# Altium schematic sheet Sheet1.SchDoc
size A
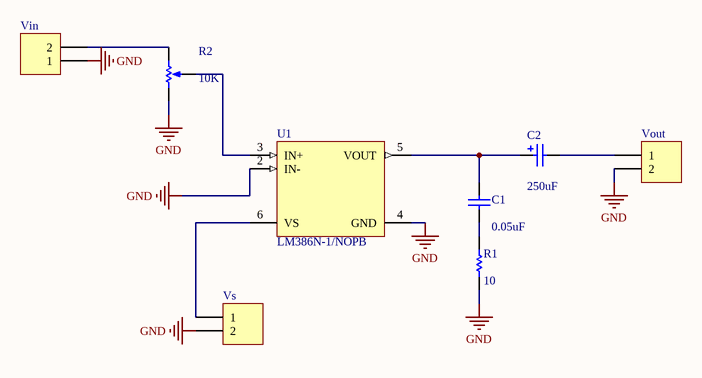
[diagram p0: Sheet1.SchDoc]

## Parts
C1  value 0.05uF  [C1206]
C2  value 250uF  [Capacitor elec 5MM (3PP)]
R1  value 10  [AXIAL-0.3]
R2  value 10K  [Pot metal slanted]
U1  LM386N-1/NOPB  [N08E]
Vin  (no value)  [HDR1X2]
Vout  (no value)  [HDR1X2]
Vs  (no value)  [HDR1X2]

## Nets
GND: R1.1 R2.1(TOP) U1.2(IN-) U1.4(GND) Vin.1 Vout.2 Vs.2
NetC1_1: C1.1 R1.2
NetC1_2: C1.2 C2.1 U1.5(VOUT)
NetC2_2: C2.2 Vout.1
NetR2_2: R2.2(TAP) U1.3(IN+)
NetR2_3: R2.3(BOT) Vin.2
NetU1_6: U1.6(VS) Vs.1

## Library data of the parts
C1 = Cap Semi: Capacitor (Semiconductor SIM Model); Published: 8-Jun-2000; LatestRevisionDate: 29-May-2009; LatestRevisionNote: IPC-7351 Footprint Added.; PackageReference: C1206; Publisher: Altium Limited; PackageDescription: Chip Capacitor
C2 = Capacitor Electrolytic
R1 = Res1: Resistor; Published: 8-Jun-2000; LatestRevisionDate: 17-Jul-2002; LatestRevisionNote: Re-released for DXP Platform.; PackageReference: AXIAL-0.3; Publisher: Altium Limited; PackageDescription: Axial Device, Thru-Hole; 2 Leads; 0.3 in Pin Spacing
R2 = Rotary Potentiometer
U1 = LM386N-1/NOPB: Low Voltage Audio Power Amplifier, 8-pin MDIP, Pb-Free; Manufacturer: National Semiconductor; PackageTopMarking: NSUZXYTTE#*LM*386N-1; PowerWise: N; CompType: Audio IC; Published: 1-Mar-2010; DatasheetVersion: Aug-2000; PackageVersion: revG, May-2006; PackageReference: N08E; Publisher: Altium Limited; PackageDescription: MDIP, .365 x .250 x .130in, 8 Lead, .100in Pitch; Supplier 1: Digi-Key; Supplier Part Number 1: LM386N-1-ND; Supplier 2: Farnell; Supplier Part Number 2: 1564702; PartNumber: LM386N-1/NOPB; RoHS: Y; PinCount: 8; Code_JEDEC: MS-001-BA; ComponentLink1Description: LM386 Datasheet; ComponentLink1URL: http://www.national.com/ds/LM/LM386.pdf; ComponentLink2Description: LM386 Web Page; ComponentLink2URL: http://www.national.com/pf/LM/LM386.html; ComponentLink3Description: N08E Package Page; ComponentLink3URL: http://www.national.com/packaging/folders/n08e.html
Vin Vout Vs = Header 2: Header, 2-Pin; LatestRevisionDate: 17-Jul-2002; LatestRevisionNote: Re-released for DXP Platform.; Publisher: Altium Limited